# Altium schematic sheet 03_Block.SchDoc
size 459 x 350 mm
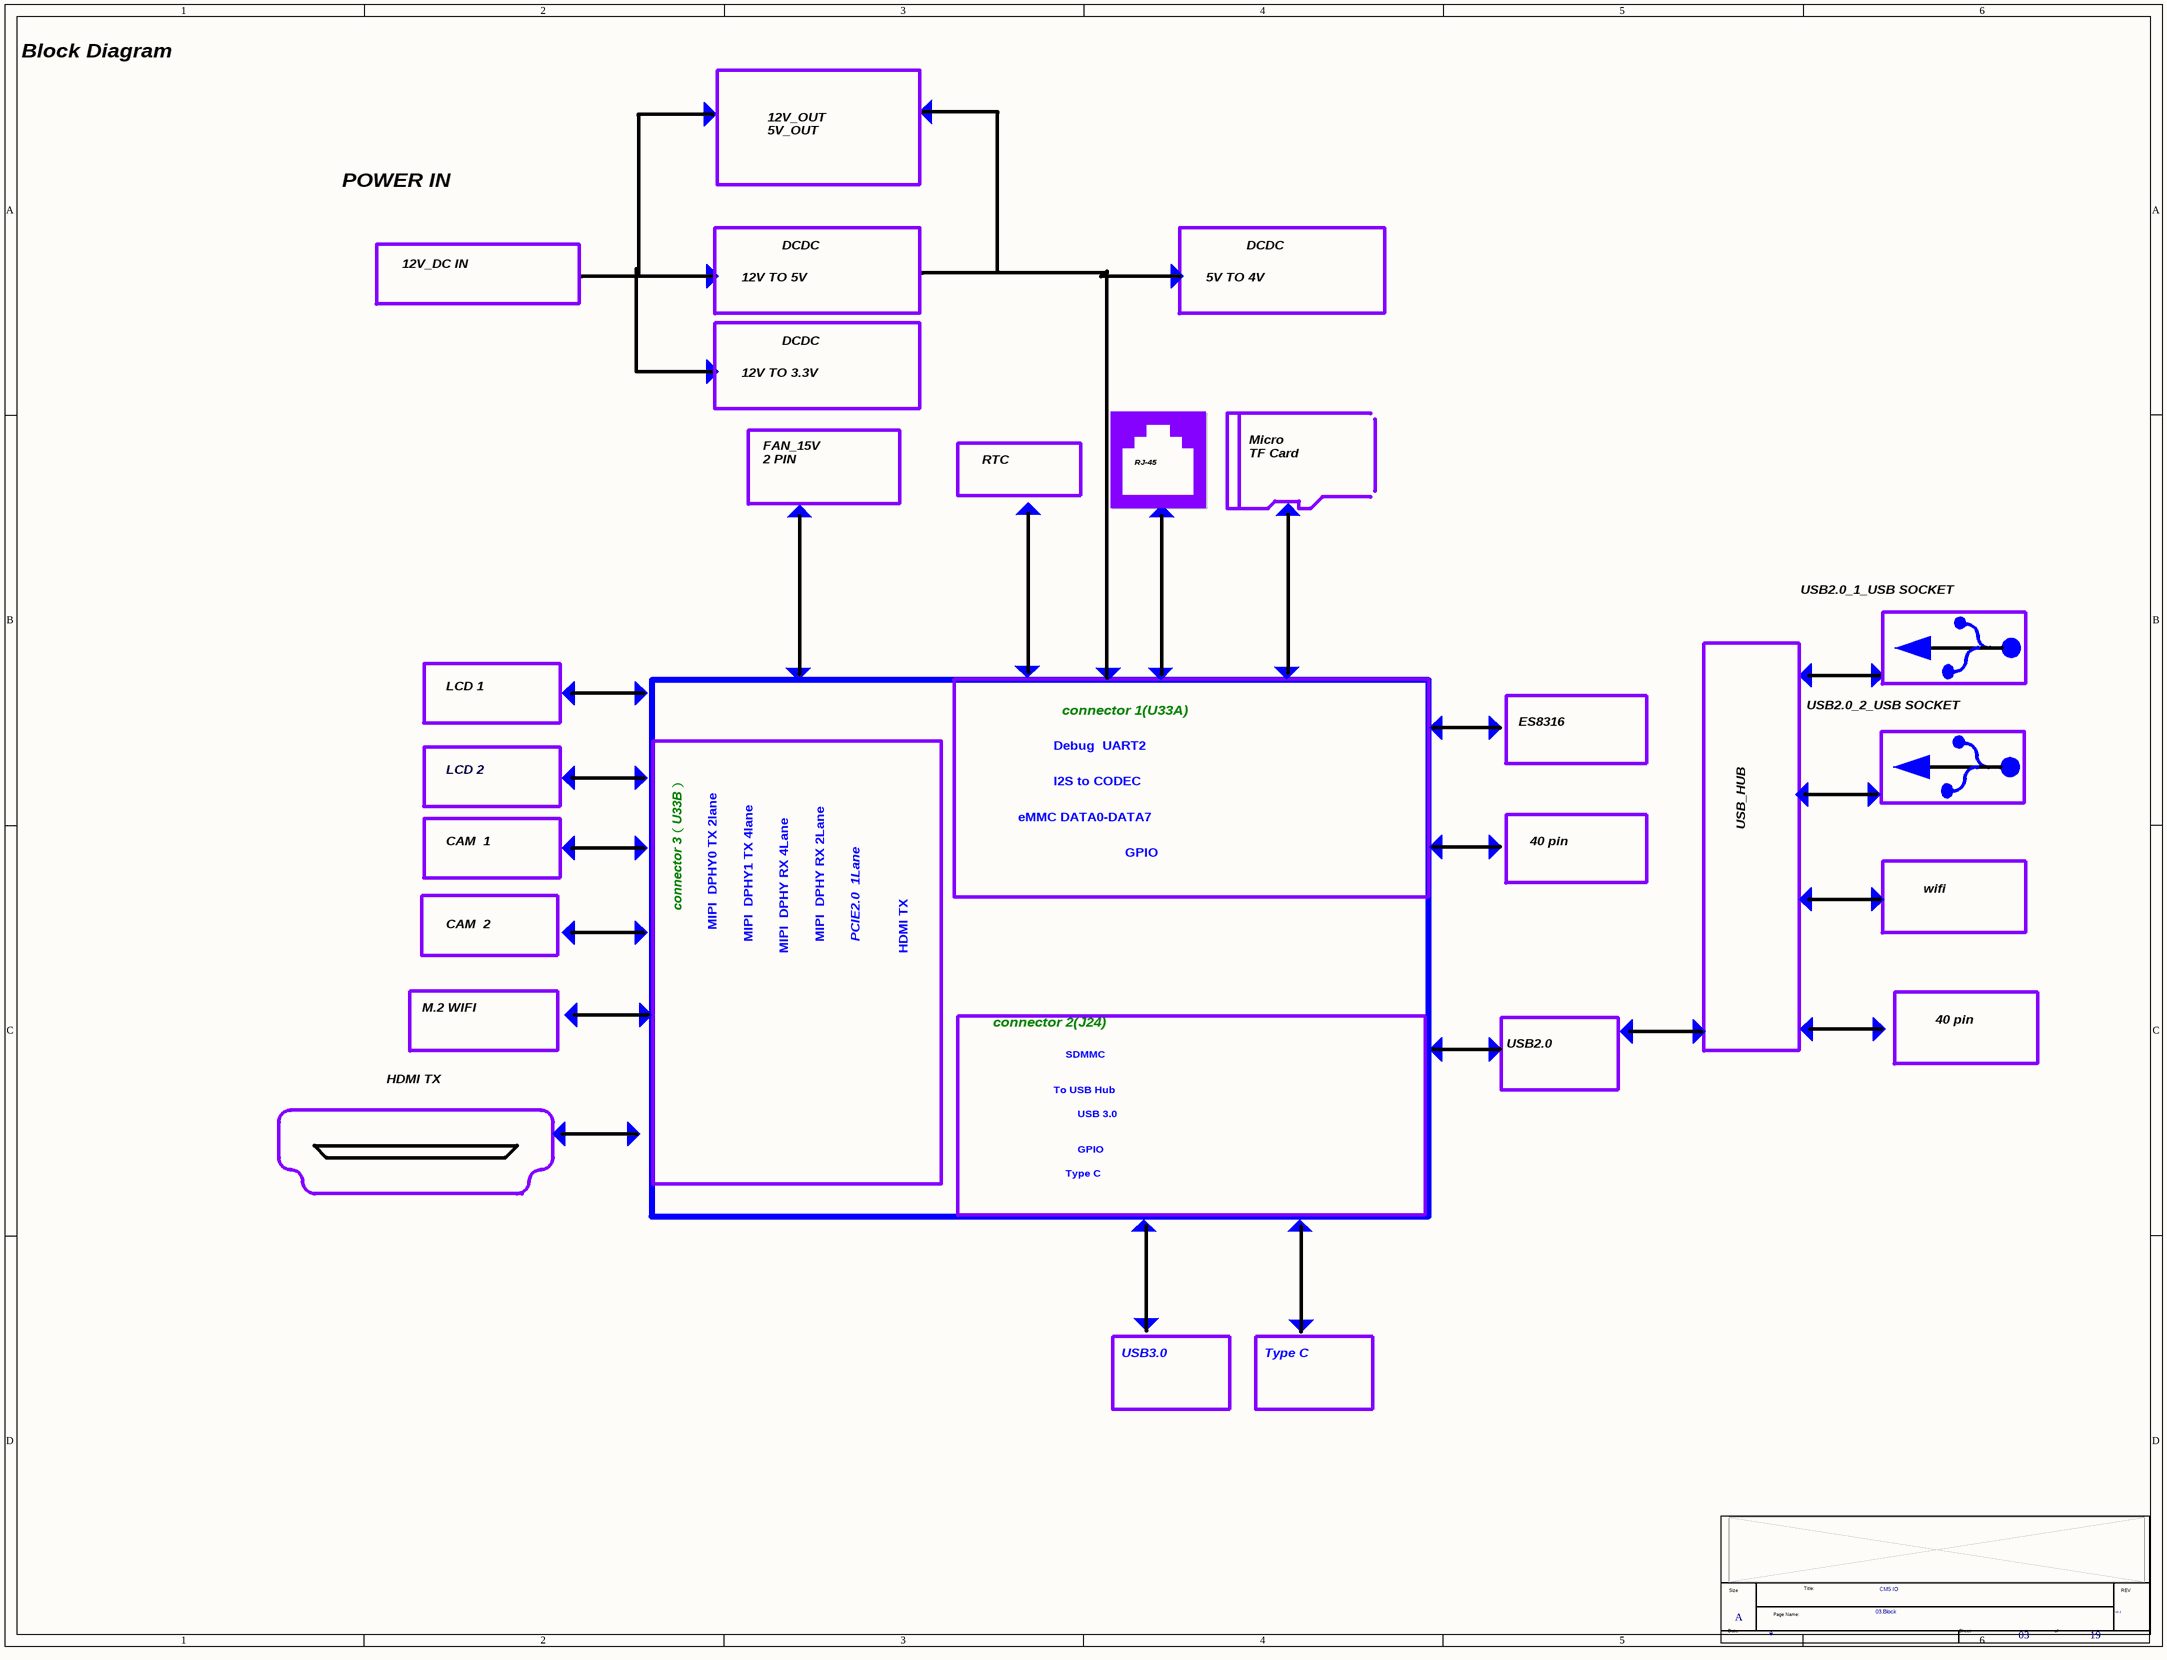
[diagram p0: 03_Block.SchDoc]

## Parts
*  Doc: 03.Block  RevCode: V2.2  Title: CM5 IO  Page Size: A  Page Number: 03  Page Count: 19  (hidden comment: radxa_1010)  (graphical)

## Notes on the sheet
- Block Diagram
- 12V_OUT
  5V_OUT
- POWER IN
- 12V_DC IN
- 12V TO 5V
- DCDC
- 5V TO 4V
- 12V TO 3.3V
- RTC
- RJ-45
- Micro
  TF Card
- FAN_15V
  2 PIN
- USB2.0_1_USB SOCKET
- LCD 1
- connector 1(U33A)
- USB2.0_2_USB SOCKET
- LCD 2
- Debug  UART2
- ES8316
- eMMC DATA0-DATA7
- I2S to CODEC
- USB_HUB
- CAM  1
- GPIO
- 40 pin
- wifi
- CAM  2
- connector 3（U33B）
- MIPI  DPHY0 TX 2lane
- MIPI  DPHY1 TX 4lane
- MIPI  DPHY RX 4Lane
- MIPI  DPHY RX 2Lane
- PCIE2.0  1Lane
- HDMI TX
- M.2 WIFI
- connector 2(J24)
- SDMMC
- USB2.0
- To USB Hub
- USB 3.0
- Type C
- USB3.0
- (in symbol radxa_1010) Size; Title:; REV; Page Name:; Date:; Sheet; of

## Library data of the parts
* = radxa_1010: Page Create Date: March  8, 1995; Page Modify Date: *